# Altium schematic sheet Communication.SchDoc
size A4
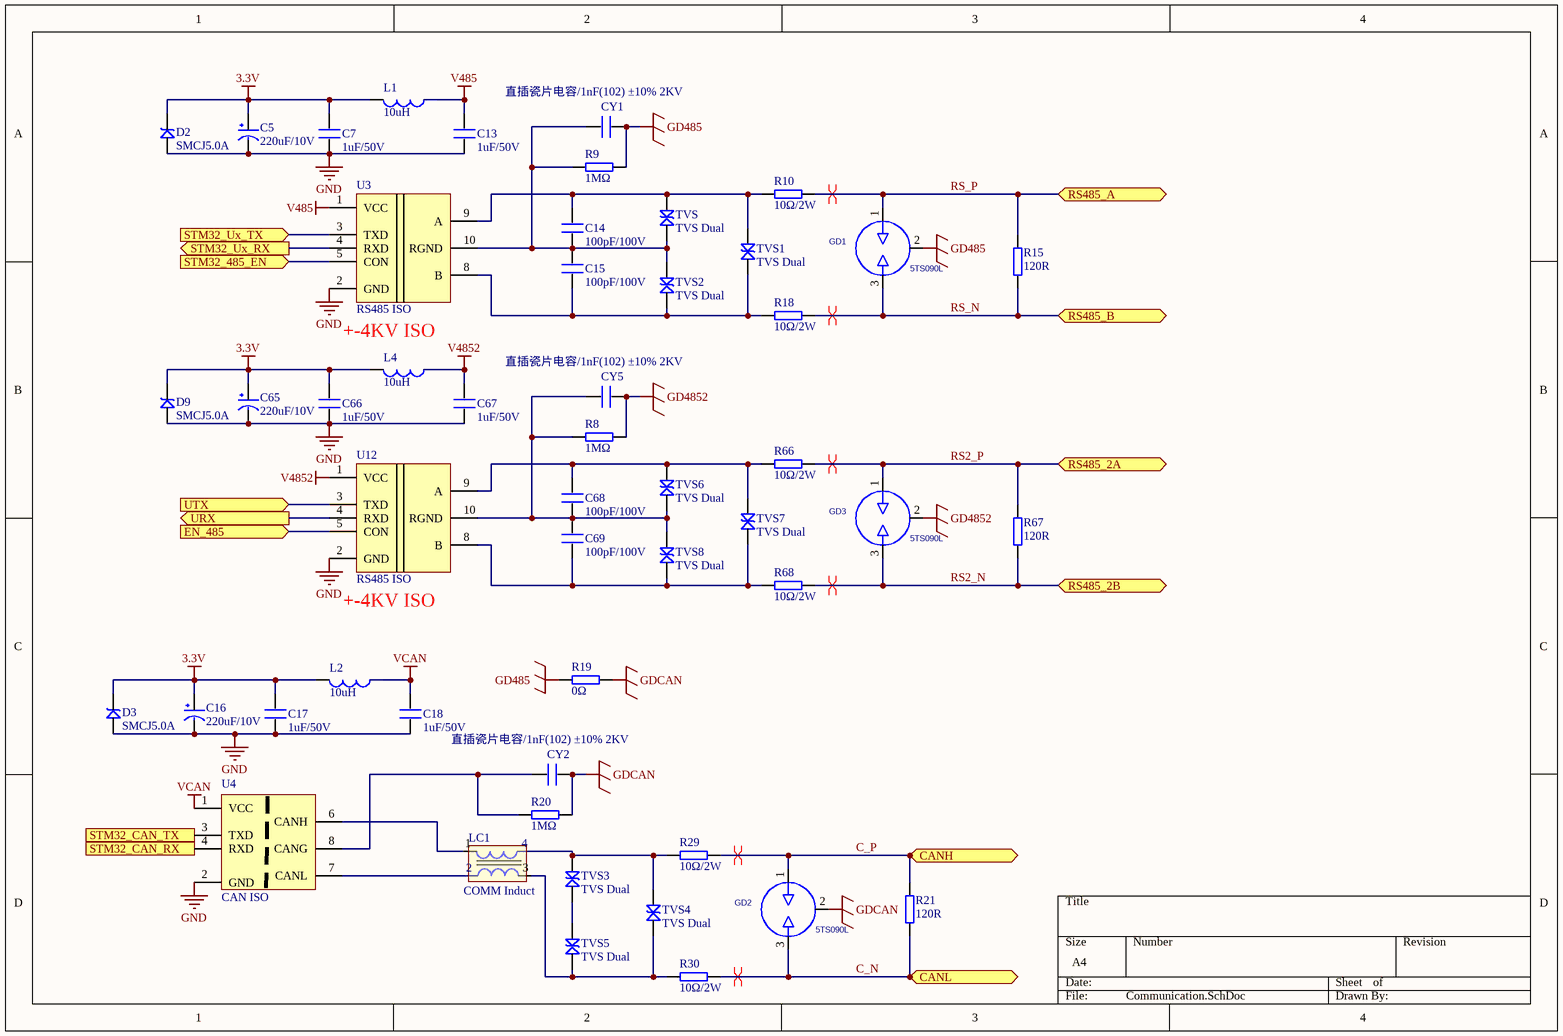
[diagram p0: Communication.SchDoc]

## Parts
C5  220uF/10V  [SMD-CT-7343]
C7  1uF/50V  [0603_C]
C13  1uF/50V  [0603_C]
C14  100pF/100V  [0603_C]
C15  100pF/100V  [0603_C]
C16  220uF/10V  [SMD-CT-7343]
C17  1uF/50V  [0603_C]
C18  1uF/50V  [0603_C]
C65  220uF/10V  [SMD-CT-7343]
C66  1uF/50V  [0603_C]
C67  1uF/50V  [0603_C]
C68  100pF/100V  [0603_C]
C69  100pF/100V  [0603_C]
CY1  直插瓷片电容/1nF(102) ±10% 2KV  [1206_C]
CY2  直插瓷片电容/1nF(102) ±10% 2KV  [1206_C]
CY5  直插瓷片电容/1nF(102) ±10% 2KV  [1206_C]
D2  SMCJ5.0A  [SMB(DO-214AA)_S1]
D3  SMCJ5.0A  [SMB(DO-214AA)_S1]
D9  SMCJ5.0A  [SMB(DO-214AA)_S1]
GD1  5TS090L  [T83-A90X]
GD2  5TS090L  [T83-A90X]
GD3  5TS090L  [T83-A90X]
L1  10uH  [0805_L]
L2  10uH  [0805_L]
L4  10uH  [0805_L]
LC1  COMM Induct
R8  1MΩ  [0603_R]
R9  1MΩ  [0603_R]
R10  10Ω/2W  [0603_R]
R15  120R  [0603_R]
R18  10Ω/2W  [0603_R]
R19  0Ω  [0603_R]
R20  1MΩ  [0603_R]
R21  120R  [0603_R]
R29  10Ω/2W  [0603_R]
R30  10Ω/2W  [0603_R]
R66  10Ω/2W  [0603_R]
R67  120R  [0603_R]
R68  10Ω/2W  [0603_R]
TVS  TVS Dual
TVS1  TVS Dual
TVS2  TVS Dual
TVS3  TVS Dual
TVS4  TVS Dual
TVS5  TVS Dual
TVS6  TVS Dual
TVS7  TVS Dual
TVS8  TVS Dual
U3  RS485 ISO
U4  CAN ISO
U12  RS485 ISO

## Ports
CANH (bidir), CANL (bidir), EN_485 (in), RS485_2A (bidir), RS485_2B (bidir), RS485_A (bidir), RS485_B (bidir), STM32_485_EN (in), STM32_CAN_RX (out), STM32_CAN_TX (in), STM32_Ux_RX (out), STM32_Ux_TX (in), URX (out), UTX (in)

## Nets
3.3V: C5.1(VCC) C7.2 C16.1(VCC) C17.2 C65.1(VCC) C66.2 D2.2 D3.2 D9.2 L1.1 L2.1 L4.1
GD485: CY1.2 GD1.2 R9.1 R19.1
GD4852: CY5.2 GD3.2 R8.1
GDCAN: CY2.2 GD2.2 R19.2 R20.1
GND: C5.2(GND) C7.1 C13.1 C16.2(GND) C17.1 C18.1 C65.2(GND) C66.1 C67.1 D2.1 D3.1 D9.1 U3.2(GND) U4.2(GND) U12.2(GND)
V485: C13.2 L1.2 U3.1(VCC)
V4852: C67.2 L4.2 U12.1(VCC)
VCAN: C18.2 L2.2 U4.1(VCC)
C_N: GD2.3 R21.1 R30.1 ; port CANL
C_P: GD2.1 R21.2 R29.1 ; port CANH
EN_485: U12.5(CON) ; port EN_485
RS2_N: GD3.3 R67.1 R68.1 ; port RS485_2B
RS2_P: GD3.1 R66.1 R67.2 ; port RS485_2A
RS_N: GD1.3 R15.1 R18.1 ; port RS485_B
RS_P: GD1.1 R10.1 R15.2 ; port RS485_A
STM32_485_EN: U3.5(CON) ; port STM32_485_EN
STM32_CAN_RX: U4.4(RXD) ; port STM32_CAN_RX
STM32_CAN_TX: U4.3(TXD) ; port STM32_CAN_TX
STM32_Ux_RX: U3.4(RXD) ; port STM32_Ux_RX
STM32_Ux_TX: U3.3(TXD) ; port STM32_Ux_TX
URX: U12.4(RXD) ; port URX
UTX: U12.3(TXD) ; port UTX
NetC14_1: C14.1 C15.2 CY1.1 R9.2 TVS.1 TVS2.2 U3.10(RGND)
NetC14_2: C14.2 R10.2 TVS.2 TVS1.2 U3.9(A)
NetC15_1: C15.1 R18.2 TVS1.1 TVS2.1 U3.8(B)
NetC68_1: C68.1 C69.2 CY5.1 R8.2 TVS6.1 TVS8.2 U12.10(RGND)
NetC68_2: C68.2 R66.2 TVS6.2 TVS7.2 U12.9(A)
NetC69_1: C69.1 R68.2 TVS7.1 TVS8.1 U12.8(B)
NetCY2_1: CY2.1 R20.2 U4.8(CANG)
NetLC1_1: LC1.1 U4.6(CANH)
NetLC1_2: LC1.2 U4.7(CANL)
NetLC1_3: LC1.3 R30.2 TVS4.1 TVS5.1
NetLC1_4: LC1.4 R29.2 TVS3.2 TVS4.2
NetTVS3_1: TVS3.1 TVS5.2

## Layout directives
differential pair: C_N, C_P, RS2_N, RS2_P, RS_N, RS_P

## Notes on the sheet
- +-4KV ISO
- (near U12) +-4KV ISO

## Library data of the parts
C5 C16 C65 = CAP: 电解电容
C7 C13-C15 C17 C18 C66-C69 CY1 CY2 CY5 = C
D2 D3 D9 = SMBJ: TVS
GD1-GD3 = EZ3-A90X_0: 气体放电管; 项目描述: 三极浪涌吸收避雷器-90V; 项目编码: 22020002; 生产厂家: EPCOS; 厂家型号: EZ3-A90X; 供应商1: EPCOS; 供应商2: /
L1 L2 L4 = L
LC1 = FL2D-Z5-103
R8 R9 R15 R19-R21 R67 = RES
R10 R18 R29 R30 R66 R68 = RES: 绕线电阻
TVS TVS1-TVS8 = TVS2
U3 U12 = TD301D485
U4 = TD301DCAN